# EAGLE design CAN Control SMD (EAGLE 9.5.2)

## Sheet 1 of 2
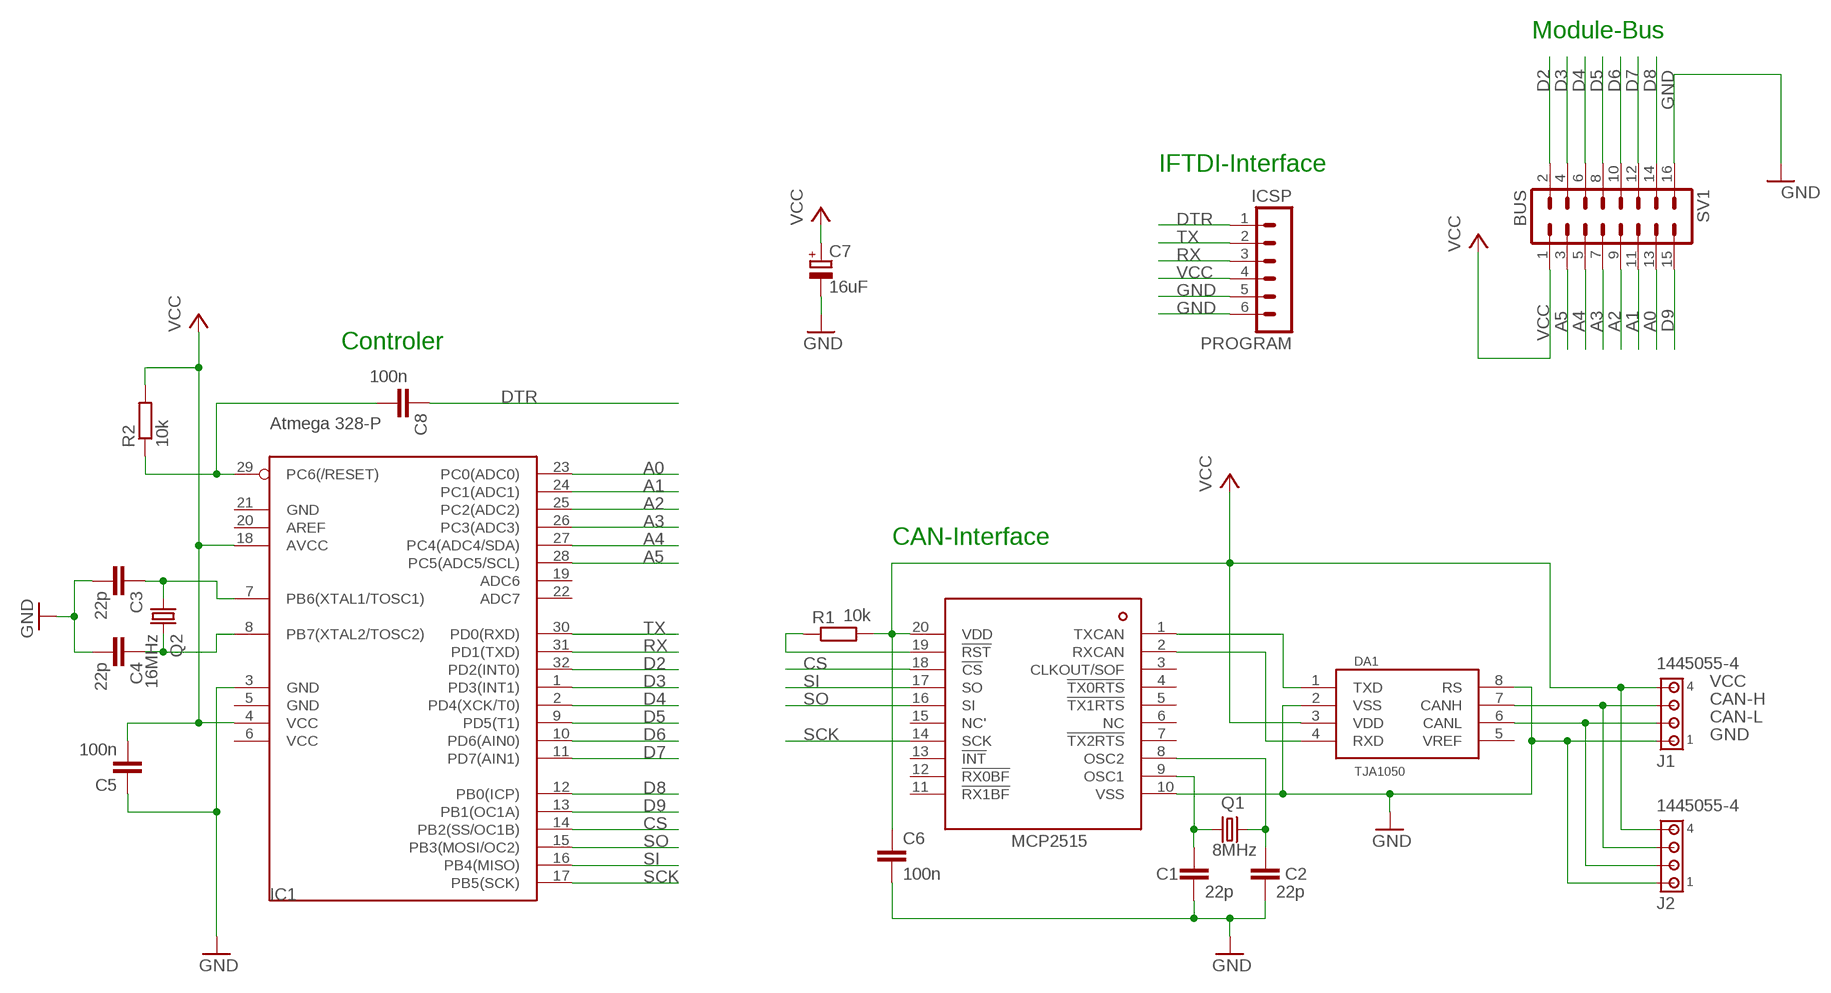
[diagram p0: schematic, sheet 1]

### Parts
C1  22p  C-EUC0402K  [C0402K]
C2  22p  C-EUC0402K  [C0402K]
C3  22p  C-EUC0402K  [C0402K]
C4  22p  C-EUC0402K  [C0402K]
C5  100n  C-EUC0402K  [C0402K]
C6  100n  C-EUC0402K  [C0402K]
C7  16uF  CPOL-EUA/3216-18W  [A/3216-18W]
C8  100n  C-EUC0402K  [C0402K]
DA1  TJA1050  [SO08]
IC1  Atmega 328-P  MEGA8-AI  [TQFP32-08]
IC2  MCP2515  [TSSOP20]
J1  1445055-4  [1445055-4]
J2  1445055-4  [1445055-4]
PROGRAM  ICSP  MA06-1  [MA06-1]
Q1  8MHz  CRYSTALHC49S  [HC49/S]
Q2  16MHz  CRYSTALHC49S  [HC49/S]
R1  10k  R-EU_MELF0102W  [MINI_MELF-0102W]
R2  10k  R-EU_MELF0102W  [MINI_MELF-0102W]
SV1  BUS  MA08-2  [MA08-2]

### Nets
A0: IC1.23(PC0(ADC0)) SV1.13
A1: IC1.24(PC1(ADC1)) SV1.11
A2: IC1.25(PC2(ADC2)) SV1.9
A3: IC1.26(PC3(ADC3)) SV1.7
A4: IC1.27(PC4(ADC4/SDA)) SV1.5
A5: IC1.28(PC5(ADC5/SCL)) SV1.3
CAN-H: DA1.7(CANH) J1.3 J2.3
CAN-L: DA1.6(CANL) J1.2 J2.2
CAN-OCC1: C1.1 IC2.9(OSC1) Q1.1
CAN-OCC2: C2.1 IC2.8(OSC2) Q1.2
CS: IC1.14(PB2(SS/OC1B)) IC2.18(!CS)
D2: IC1.32(PD2(INT0)) SV1.2
D3: IC1.1(PD3(INT1)) SV1.4
D4: IC1.2(PD4(XCK/T0)) SV1.6
D5: IC1.9(PD5(T1)) SV1.8
D6: IC1.10(PD6(AIN0)) SV1.10
D7: IC1.11(PD7(AIN1)) SV1.12
D8: IC1.12(PB0(ICP)) SV1.14
D9: IC1.13(PB1(OC1A)) SV1.15
DTR: C8.1 PROGRAM.1
GND: C1.2 C2.2 C3.2 C4.2 C5.1 C6.2 C7.- DA1.2(VSS) DA1.8(RS) IC1.3(GND) IC2.10(VSS) J1.1 J2.1 PROGRAM.5 PROGRAM.6 SV1.16
N$6: IC2.19(!RST) R1.1
N$10: C3.1 IC1.7(PB6(XTAL1/TOSC1)) Q2.1
N$11: C4.1 IC1.8(PB7(XTAL2/TOSC2)) Q2.2
N$15: C8.2 IC1.29(PC6(/RESET)) R2.1
RX: IC1.31(PD1(TXD)) PROGRAM.3
RXCAN: DA1.4(RXD) IC2.2(RXCAN)
SCK: IC1.17(PB5(SCK)) IC2.14(SCK)
SI: IC1.16(PB4(MISO)) IC2.17(SO)
SO: IC1.15(PB3(MOSI/OC2)) IC2.16(SI)
TX: IC1.30(PD0(RXD)) PROGRAM.2
TXCAN: DA1.1(TXD) IC2.1(TXCAN)
VCC: C5.2 C6.1 C7.+ DA1.3(VDD) IC1.4(VCC) IC1.18(AVCC) IC2.20(VDD) J1.4 J2.4 PROGRAM.4 R1.2 R2.2 SV1.1
Unconnected: DA1.5(VREF) IC1.19(ADC6) IC1.20(AREF) IC1.22(ADC7) IC2.3(CLKOUT/SOF) IC2.4(!TX0RTS) IC2.5(!TX1RTS) IC2.6(NC) IC2.7(!TX2RTS) IC2.11(!RX1BF) IC2.12(!RX0BF) IC2.13(!INT) IC2.15(NC')

### Notes on the sheet
- Module-Bus
- IFTDI-Interface
- Controler
- CAN-Interface

## Sheet 2 of 2

## Power pins joined to a net without a drawn wire
GND: IC1.5(GND) IC1.21(GND)
VCC: IC1.6(VCC)

## Library data of the parts
C1-C6 C8 = rcl:C-EU: CAPACITOR, European symbol; SPICEPREFIX: C
C7 = rcl:CPOL-EU: POLARIZED CAPACITOR, European symbol; SPICEPREFIX: C
DA1 = TJA1050:TJA1050: High speed CAN transceiver Input levels compatible with 3.3 V and 5 V devices 5V supply
IC1 = atmel:MEGA8: MICROCONTROLLER 8 Kbytes FLASH, 1 kbytes SRAM, 512 bytes EEPROM, USART, 6-channel 10 bit ADC, 2-channel 8 bit ADC Pin compatible with Atmega48, ATMega88, ATMega168 Source: avr.lbr; MPN: ATMEGA8-16AU; OC_FARNELL: 9171371; OC_NEWARK: 73M8863
IC2 = mcp2514:MCP2515: Microchip Technology’s MCP2515 is a stand-alone Controller Area Network (CAN) controller that implements the CAN specification, version 2.0B. It is capable of transmitting and receiving both standard and extended data and remote frames. The MCP2515 has two acceptance masks and six acceptance filters that are used to filter out unwanted messages, thereby reducing the host MCUs overhead. The MCP2515 interfaces with microcontrollers (MCUs) via an industry standard Serial Peripheral Interface (SPI).
J1 J2 = con-amp:1445055-4: Micro MATE-N-LOK Connectors grid 1.5 mm Source: ENG_CD_1445055_A.pdf
PROGRAM = con-lstb:MA06-1: PIN HEADER; OC_FARNELL: unknown; OC_NEWARK: unknown
Q1 Q2 = crystal:CRYSTAL: CRYSTAL; OC_FARNELL: 1667008; OC_NEWARK: unknown
R1 R2 = rcl:R-EU_: RESISTOR, European symbol; SPICEPREFIX: R
SV1 = con-lstb:MA08-2: PIN HEADER; OC_FARNELL: unknown; OC_NEWARK: unknown

## Board
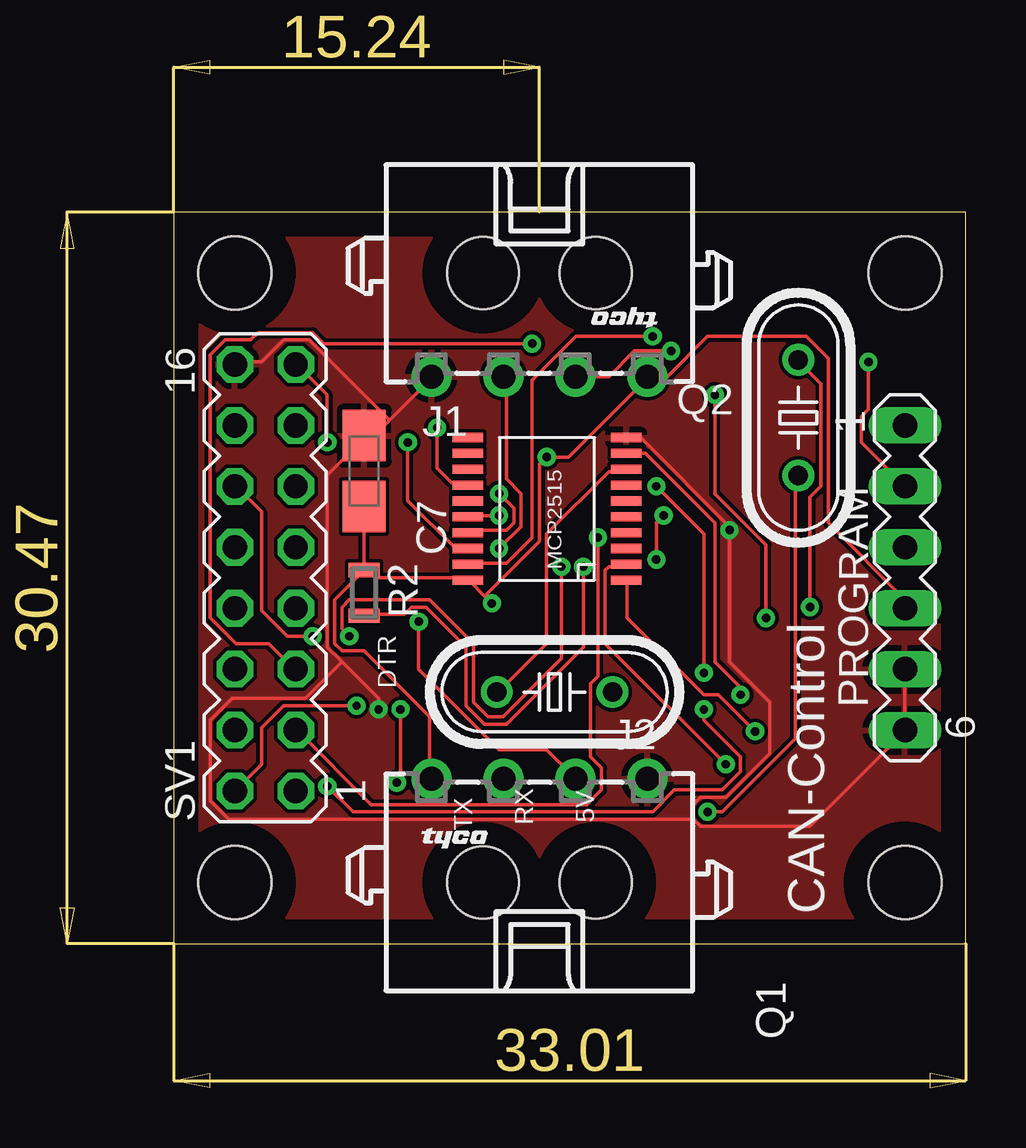
[diagram p1: board, top side]
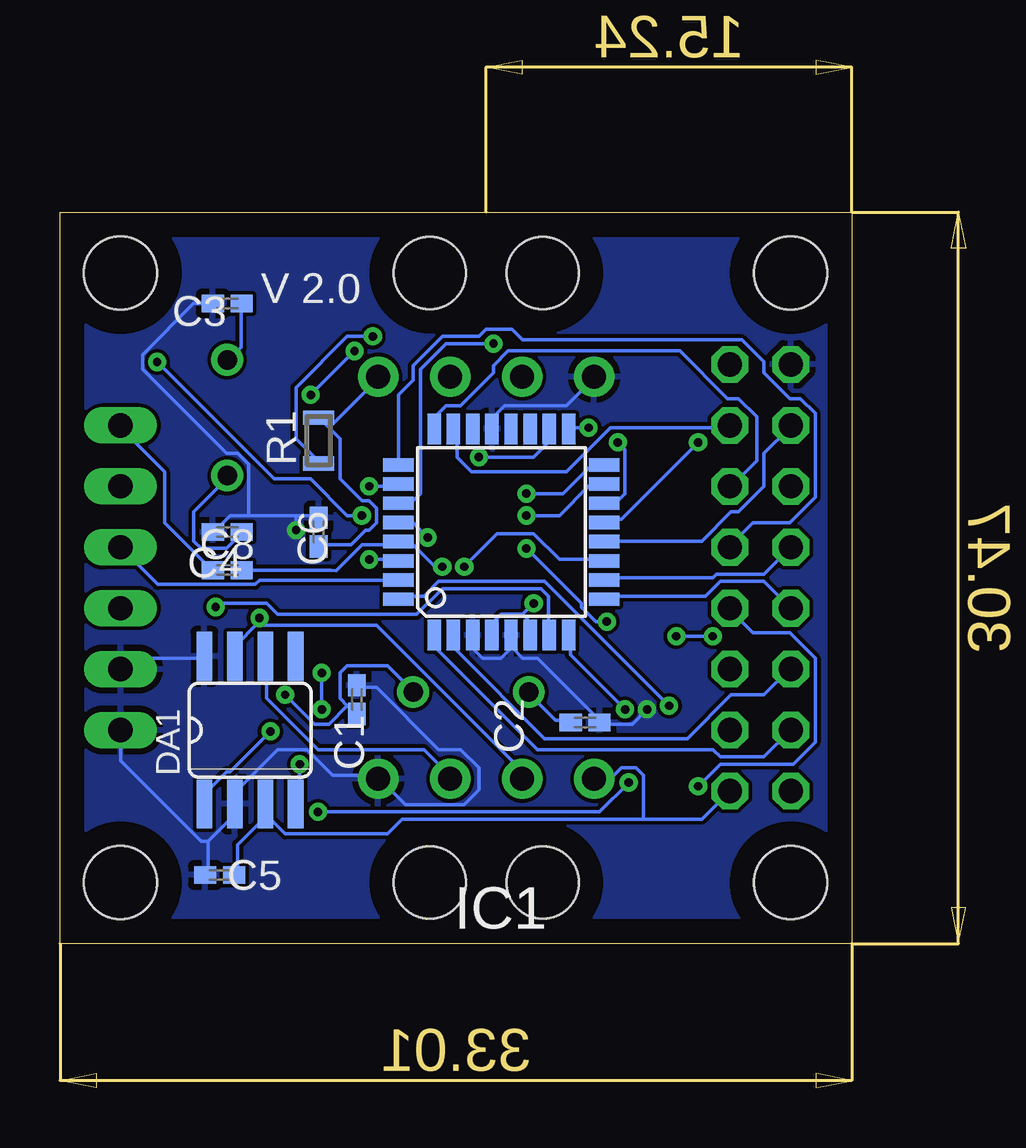
[diagram p2: board, bottom side, seen from below]

Size 33.01 x 30.47 mm. Coordinates in mm from the lower left corner, seen from the top.
Outline: 0,0 33.01,0 33.01,30.47 0,30.47 0,0
Copper layers (1*16): Top 0.035mm / dielectric 1.5mm / Bottom 0.035mm
Design rules "default": minimum track width 6mil, minimum drill 0.35mm, track to track 6mil, track to pad 6mil, pad to pad 6mil, via to via 6mil, smd to smd 6mil, copper to edge 40mil, drill to drill 6mil, minimum pad ring 10mil, minimum via ring 8mil, stop-mask expansion 4mil, vias tented up to drill 0mil, thermal gap 10mil
Holes 3.05 mm at 2.54,27.94 2.54,2.54 30.48,2.54 30.48,27.94

### Footprints (pad centres in the part's own frame; a part is rotated, then mirrored left to right if it is on the bottom)
C0402K = smd 0.925 x 0.74: 1 -0.6,0; 2 0.6,0
A/3216-18W = smd 2.15 x 1.8: + 1.475,0; - -1.475,0
SO08 = smd 0.66 x 2.032: 1 -1.905,-3.073; 2 -0.635,-3.073; 3 0.635,-3.073; 4 1.905,-3.073; 5 1.905,3.073; 6 0.635,3.073; 7 -0.635,3.073; 8 -1.905,3.073
TQFP32-08 = smd 1.27 x 0.559: 1 -4.293,2.8; 2 -4.293,2; 3 -4.293,1.2; 4 -4.293,0.4; 5 -4.293,-0.4; 6 -4.293,-1.2; 7 -4.293,-2; 8 -4.293,-2.8; 17 4.293,-2.8; 18 4.293,-2; 19 4.293,-1.2; 20 4.293,-0.4; 21 4.293,0.4; 22 4.293,1.2; 23 4.293,2; 24 4.293,2.8 | smd 0.559 x 1.27: 9 -2.8,-4.293; 10 -2,-4.293; 11 -1.2,-4.293; 12 -0.4,-4.293; 13 0.4,-4.293; 14 1.2,-4.293; 15 2,-4.293; 16 2.8,-4.293; 25 2.8,4.293; 26 2,4.293; 27 1.2,4.293; 28 0.4,4.293; 29 -0.4,4.293; 30 -1.2,4.293; 31 -2,4.293; 32 -2.8,4.293
TSSOP20 = smd 1.27 x 0.381: 1 -3.302,2.642; 2 -3.302,1.981; 3 -3.302,1.321; 4 -3.302,0.66; 5 -3.302,0; 6 -3.302,-0.66; 7 -3.302,-1.321; 8 -3.302,-1.981; 9 -3.302,-2.642; 10 -3.302,-3.302; 11 3.302,-3.302; 12 3.302,-2.642; 13 3.302,-1.981; 14 3.302,-1.321; 15 3.302,-0.66; 16 3.302,0; 17 3.302,0.66; 18 3.302,1.321; 19 3.302,1.981; 20 3.302,2.642
1445055-4 = drill 1 pad 1.676: 1 4.5,4.32; 2 1.5,4.32; 3 -1.5,4.32; 4 -4.5,4.32 | hole 3: -2.35,0; 2.35,0
MA06-1 = drill 1.016 long: 1 -6.35,0; 2 -3.81,0; 3 -1.27,0; 4 1.27,0; 5 3.81,0; 6 6.35,0
HC49/S = drill 0.813: 1 -2.413,0; 2 2.413,0
MINI_MELF-0102W = smd 0.6 x 1.3: 1 -0.95,0; 2 0.95,0
MA08-2 = drill 1.016 octagon: 1 -8.89,-1.27; 2 -8.89,1.27; 3 -6.35,-1.27; 4 -6.35,1.27; 5 -3.81,-1.27; 6 -3.81,1.27; 7 -1.27,-1.27; 8 -1.27,1.27; 9 1.27,-1.27; 10 1.27,1.27; 11 3.81,-1.27; 12 3.81,1.27; 13 6.35,-1.27; 14 6.35,1.27; 15 8.89,-1.27; 16 8.89,1.27

### Placement (x,y rotation side)
C1  20.64,10.16 90 bottom
C2  11.11,9.21 0 bottom
C3  26.04,26.67 180 bottom
C4  26.04,17.14 180 bottom
C5  26.35,2.86 0 bottom
C6  22.23,17.14 90 bottom
C7  7.94,19.68 270 top
C8  26.04,15.56 0 bottom
DA1  25.08,8.89 0 bottom
IC1  14.61,17.14 90 bottom
IC2  15.56,17.78 180 top
J1  15.24,27.94 180 top
J2  15.24,2.54 0 top
PROGRAM  30.48,15.24 270 top
Q1  15.88,10.48 180 top
Q2  26.04,21.91 270 top
R1  22.23,20.95 90 bottom
R2  7.94,14.61 90 top
SV1  3.81,15.24 90 top

### Tracks (layer width: path | path; a pad name or v marks a point on that pad's centre or on a via)
A0
  Bottom 0.152: IC1.23 16.46,21.34 16.46,20.27 15.85,19.66 11.89,19.66 10.06,21.49 5.18,21.49 SV1.13
A1
  Bottom 0.152: IC1.24 17.37,21.49 17.37,21.95 16.92,22.4 16.31,22.4 14.94,23.77 14.94,24.08 14.33,24.69 7.16,24.69 5.18,22.71 4.72,22.71 3.96,21.95 3.96,20.12 5.03,19.05 SV1.11
A2
  Bottom 0.152: IC1.25 18.9,22.86 18.29,23.47 18.29,24.08 17.07,25.3 15.54,25.3 15.24,25.6 14.17,25.6 13.72,25.15 4.57,25.15 3.66,24.23 3.66,23.77 2.59,22.71 2.13,22.71 1.52,22.1 1.52,18.59 2.59,17.53 4.12,17.53 5.03,16.61 SV1.9
A3  (via drill 0.35)
  Top 0.152: v20.12,19.05 22.1,17.07 v22.1,11.28 | v22.1,9.75 22.1,9.3 23.62,7.77 23.62,7.16 22.86,6.4 20.88,6.4 19.96,5.49 7.47,5.49 v6.4,6.55
  Bottom 0.152: v20.12,19.05 18.9,19.05 IC1.26 | v22.1,9.75 v22.1,11.28 | v6.4,6.55 5.49,7.47 2.44,7.47 1.52,8.38 1.52,11.89 2.59,12.95 4.12,12.95 5.03,13.87 SV1.7
A4  (via drill 0.35)
  Top 0.152: v14.94,24.99 6.25,24.99 5.79,25.45 3.5,25.45 3.2,25.15 2.13,25.15 1.52,24.54 1.52,13.56 2.59,12.5 3.96,12.5 5.03,11.43 SV1.5
  Bottom 0.152: v14.94,24.99 16.92,24.99 17.98,23.93 17.98,18.75 18.29,18.44 18.9,18.44 IC1.27
A5  (via drill 0.35)
  Top 0.152: v17.68,16.92 17.68,11.12 17.37,10.82 17.37,7.77 17.83,7.32 17.83,6.4 17.22,5.79 8.23,5.79 5.18,8.84 SV1.3
  Bottom 0.152: v17.68,16.92 18.29,17.53 18.9,17.53 IC1.28
CAN-H  (via drill 0.35)
  Top 0.152: v20.73,24.69 19.2,24.69 18.14,23.62 16.76,23.62 J1.3 | v22.55,22.86 22.55,18.75 24.69,16.61 v24.69,13.56
  Bottom 0.152: 24.69,13.26 19.81,13.26 13.87,7.32 13.87,7.01 J2.3 | 24.69,13.26 24.84,13.26 25.6,12.5 25.6,12.04 DA1.7 | v22.55,22.86 v20.73,24.69 | 24.69,13.26 v24.69,13.56
CAN-L  (via drill 0.35)
  Top 0.152: v13.56,16.46 14.48,17.37 14.48,18.75 13.87,19.36 13.87,23.47 J1.2 | v10.21,13.41 10.21,11.43 13.56,8.08 15.54,8.08 16.61,7.01 J2.2
  Bottom 0.152: DA1.6 24.38,11.89 24.38,10.21 22.25,8.08 17.83,8.08 16.76,7.01 J2.2 | v13.56,16.46 11.28,14.17 11.28,14.02 10.67,13.41 v10.21,13.41
CAN-OCC1  (via drill 0.35)
  Top 0.152: IC2.9 19.66,20.42 22.55,17.53 22.55,11.73 23.62,10.67 v23.62,10.36
  Bottom 0.152: 21.03,9.91 21.34,10.21 21.34,11.28 21.03,11.58 19.36,11.58 18.29,10.52 Q1.1 | 21.03,9.91 20.73,9.6 C1.1 | v23.62,10.36 22.4,9.14 21.79,9.14 21.03,9.91
CAN-OCC2
  Top 0.152: IC2.8 18.75,19.66 18.14,19.66 15.54,17.07 15.54,12.5 13.56,10.52 Q1.2
  Bottom 0.152: C2.1 11.73,9.3 12.34,9.3 13.41,10.36 Q1.2
CS  (via drill 0.35)
  Top 0.152: IC2.18 11.73,16.46 9.75,18.44 v9.75,20.88
  Bottom 0.152: v9.75,20.88 9.45,20.57 9.45,18.75 9.75,18.44 10.21,18.44 IC1.14
D2  (via drill 0.35)
  Top 0.152: v7.62,9.91 4.57,9.91 3.66,8.99 3.66,7.47 SV1.2
  Bottom 0.152: v7.62,9.91 12.8,15.09 17.22,15.09 17.83,14.48 18.9,14.48 IC1.32
D3
  Bottom 0.152: SV1.4 3.66,7.77 5.49,7.77 5.79,8.08 13.11,8.08 17.37,12.34 17.37,12.8 IC1.1
D4
  Bottom 0.152: IC1.2 16.46,12.8 16.46,12.19 12.8,8.53 6.86,8.53 5.03,10.36 3.66,10.36 2.59,11.43 SV1.6
D5
  Bottom 0.152: SV1.8 3.66,15.09 5.49,15.09 6.1,14.48 10.21,14.48 IC1.9
D6
  Bottom 0.152: SV1.10 3.66,15.39 5.64,15.39 5.79,15.24 10.21,15.24 IC1.10
D7  (via drill 0.35)
  Top 0.152: v16.15,15.7 16.15,11.89 13.72,9.45 13.11,9.45 12.5,10.06 12.5,12.5 10.67,14.33 7.32,14.33 7.01,14.02 7.01,13.11 v7.32,12.8 | v5.79,12.8 4.72,12.8 3.66,13.87 3.66,17.98 2.59,19.05 SV1.12
  Bottom 0.152: v16.15,15.7 14.78,17.07 13.26,17.07 12.19,16 10.36,16 IC1.11 | v5.79,12.8 v7.32,12.8
D8
  Bottom 0.152: IC1.12 10.21,16.76 6.25,16.76 5.03,17.98 4.72,17.98 3.66,19.05 3.66,20.42 2.59,21.49 SV1.14
D9  (via drill 0.35)
  Top 0.152: v6.4,20.88 6.4,22.86 5.18,24.08 SV1.15
  Bottom 0.152: v6.4,20.88 9.6,17.68 10.21,17.68 IC1.13
DTR
  Bottom 0.152: C8.1 26.71,15.59 28.65,17.53 28.65,19.66 30.48,21.49 PROGRAM.1
GND  (via drill 0.35)
  Top 0.152: 8.99,21.79 10.67,23.47 J1.1 | 8.99,21.79 8.38,21.18 8.08,21.18 C7.- 7.92,21.03 6.4,19.51 6.4,12.34 7.01,11.73 | 8.99,21.79 5.64,25.15 4.57,25.15 3.66,24.23 2.59,24.23 SV1.16 | v8.53,9.75 8.53,10.21 7.01,11.73 | IC2.10 18.9,21.03 19.51,21.03 23.16,17.37 v23.16,17.22 23.16,11.73 24.84,10.06 24.84,7.92 23.01,6.1 21.95,6.1 21.64,5.79 21.64,5.18 | PROGRAM.5 PROGRAM.6 30.48,8.84 26.52,4.88 21.95,4.88 21.64,5.18 | 7.01,11.73 5.49,10.21 2.44,10.21 1.52,9.3 1.52,5.94 2.29,5.18 21.64,5.18
  Bottom 0.152: 14.17,12.34 13.72,11.89 13.11,11.89 10.52,9.3 C2.2 10.36,9.14 9.14,9.14 v8.53,9.75 | 14.17,12.34 14.17,12.8 IC1.5 14.17,12.34 | 14.17,12.34 14.63,11.89 15.39,11.89 15.7,12.19 15.7,12.8 IC1.3 | IC1.21 14.94,21.49 14.94,21.95 14.48,22.4 11.89,22.4 10.82,23.47 J1.1 | 23.16,17.83 22.25,17.83 C6.2 | 23.16,17.83 25.15,17.83 | 25.15,17.83 25.91,17.83 26.52,17.22 C4.2 | C3.2 27.43,26.67 29.57,24.54 29.57,23.93 26.06,20.42 25.6,20.42 25.15,19.96 25.15,17.83 | 23.16,17.83 v23.16,17.22 | C1.2 20.57,10.67 19.81,10.67 17.22,8.08 16.31,8.08 15.54,7.32 15.54,6.4 16.15,5.79 18.59,5.79 19.66,6.86 J2.1 19.81,7.01 21.64,7.01 22.71,8.08 23.93,8.08 25.6,6.4 25.6,5.94 DA1.2 25.76,5.79 25.76,5.33 26.82,4.27 | PROGRAM.5 30.02,11.89 27.13,11.89 DA1.8 | 26.82,4.27 26.82,2.9 C5.1 | 26.82,4.27 27.13,4.27 30.48,7.62 PROGRAM.6
  pour Bottom: 0,30.48 33.02,30.48 33.02,0 0,0
  pour Top: 0,30.48 33.02,30.48 33.02,0 0,0
N$6  (via drill 0.35)
  Top 0.152: v19.96,25.3 16.76,25.3 14.94,23.47 14.94,16.92 13.87,15.85 12.34,15.85 IC2.19
  Bottom 0.152: v19.96,25.3 21.03,25.3 23.16,23.16 23.16,21.03 22.25,20.12 R1.1
N$10  (via drill 0.35)
  Top 0.152: v26.52,14.02 26.52,18.59 26.98,19.05 26.98,23.32 26.06,24.23 Q2.1
  Bottom 0.152: C3.1 25.45,26.67 25.45,24.84 25.91,24.38 Q2.1 | v26.52,14.02 26.36,14.17 24.38,14.17 23.93,13.72 18.14,13.72 17.07,14.78 12.95,14.78 12.65,14.48 12.65,12.95 IC1.7
N$11  (via drill 0.35)
  Top 0.152: v9.45,9.75 9.45,6.86 v9.3,6.71 | v22.25,5.49 22.86,5.49 25.91,8.53 25.91,19.36 Q2.2
  Bottom 0.152: C4.1 25.45,17.07 26.06,16.46 27.13,16.46 27.43,16.76 27.43,17.98 26.06,19.36 Q2.2 | v9.45,9.75 11.73,12.04 11.73,12.8 IC1.8 | v9.3,6.71 10.52,5.49 v22.25,5.49
N$15  (via drill 0.35)
  Top 0.152: v17.07,15.7 17.07,12.34 13.87,9.14 12.95,9.14 12.19,9.91 12.19,12.34 10.52,14.02 9.91,14.02 9.6,13.72 8.08,13.72 R2.1
  Bottom 0.152: 18.9,16.61 20.42,16.61 21.5,15.54 21.7,15.56 C8.2 | v17.07,15.7 17.37,15.7 18.29,16.61 18.9,16.61 | 18.9,16.61 IC1.29
RX
  Bottom 0.152: IC1.31 24.69,15.14 24.88,14.96 28.93,14.96 PROGRAM.3
RXCAN  (via drill 0.35)
  Top 0.152: v23.01,7.47 17.98,12.5 17.98,15.54 18.14,15.7 18.75,15.7 IC2.2
  Bottom 0.152: v23.01,7.47 23.01,6.1 23.16,5.94 DA1.4
SCK  (via drill 0.35)
  Top 0.152: v10.97,21.49 10.97,19.81 11.58,19.2 12.19,19.2 IC2.14
  Bottom 0.152: v10.97,21.49 11.73,21.49 IC1.17
SI  (via drill 0.35)
  Top 0.152: v13.56,18.75 14.17,18.14 14.17,17.53 13.87,17.22 12.34,17.22 IC2.17
  Bottom 0.152: v13.56,18.75 12.04,18.75 10.97,19.81 10.36,19.81 IC1.16
SO  (via drill 0.35)
  Top 0.152: v13.56,17.83 12.34,17.83 IC2.16
  Bottom 0.152: v13.56,17.83 12.19,17.83 10.97,19.05 10.36,19.05 IC1.15
TX  (via drill 0.35)
  Top 0.152: v20.12,16 20.12,17.53 v20.42,17.83 | v28.96,24.23 28.96,22.25 28.65,21.95 28.65,20.88 PROGRAM.2
  Bottom 0.152: v20.12,16 18.9,16 IC1.30 | v20.42,17.83 21.03,17.83 22.55,19.36 24.08,19.36 v28.96,24.23
TXCAN  (via drill 0.35)
  Top 0.152: v24.23,8.84 22.71,10.36 22.1,10.36 18.9,13.56 18.9,15.09 IC2.1
  Bottom 0.152: v24.23,8.84 25.91,7.16 26.06,7.16 26.98,6.25 26.98,5.94 DA1.1
VCC  (via drill 0.35)
  Top 0.152: R2.2 8.08,15.54 8.38,15.24 12.19,15.24 IC2.20 12.34,15.09 12.95,14.48 | 12.95,14.48 v13.26,14.17 | C7.+ 7.92,18.14 7.92,15.7 R2.2 | PROGRAM.4 30.48,14.33 27.28,17.53 27.28,24.38 26.36,25.3 22.25,25.3 20.57,23.62 19.81,23.62 J1.4 19.66,23.47 16.46,20.27 v15.54,20.27 15.24,19.96 15.24,16.76 12.95,14.48 | J2.4 10.67,7.01 10.67,9.45 7.92,12.19 7.01,12.19 6.71,12.5 6.71,14.33 7.92,15.54 R2.2
  Bottom 0.152: 24.54,5.18 25.6,4.12 25.6,2.9 C5.2 | 24.54,5.18 24.54,5.79 DA1.3 24.54,5.18 | 24.54,5.18 24.23,5.18 23.62,4.57 19.36,4.57 18.75,5.18 8.69,5.18 | 8.69,5.18 6.25,5.18 SV1.1 | 8.69,5.18 8.69,7.01 8.99,7.32 9.6,7.32 9.91,7.01 10.67,7.01 J2.4 | 13.72,13.72 13.41,13.41 13.41,12.95 IC1.6 | 13.72,13.72 14.63,13.72 14.94,13.41 14.94,12.95 IC1.4 | v13.26,14.17 13.72,13.72 | 21.79,21.49 22.1,21.79 R1.2 | 21.79,21.49 21.34,21.03 21.34,19.36 20.42,18.44 20.12,18.44 19.81,18.14 19.81,17.53 20.12,17.22 20.27,17.22 20.88,16.61 22.1,16.61 C6.1 | v15.54,20.27 13.26,20.27 12.65,20.88 12.65,21.34 IC1.18 | 21.79,21.49 19.81,23.47 J1.4

### Text on the board
tNames: DTR | CAN-Control | RX | 5V | TX
bNames: V 2.0